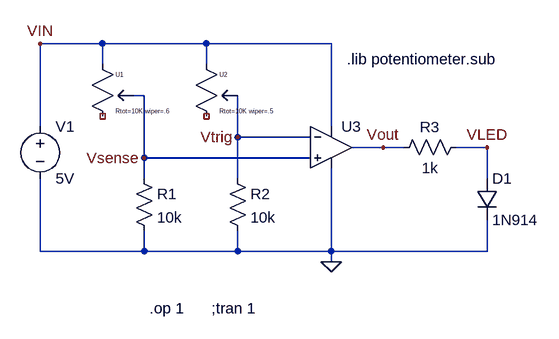
[diagram p0: schematic gas_detector_milestone1.asc]
gas_detector_milestone1.asc, the LTspice schematic file:
Version 4
SHEET 1 928 680
WIRE 96 96 0 96
WIRE 256 96 96 96
WIRE 448 96 256 96
WIRE 96 128 96 96
WIRE 256 128 256 96
WIRE 160 176 144 176
WIRE 0 224 0 96
WIRE 448 224 448 96
WIRE 304 240 304 176
WIRE 416 240 304 240
WIRE 528 256 480 256
WIRE 560 256 528 256
WIRE 688 256 640 256
WIRE 160 272 160 176
WIRE 416 272 160 272
WIRE 160 304 160 272
WIRE 304 304 304 240
WIRE 688 304 688 256
WIRE 0 416 0 304
WIRE 160 416 160 384
WIRE 160 416 0 416
WIRE 304 416 304 384
WIRE 304 416 160 416
WIRE 448 416 448 288
WIRE 448 416 304 416
WIRE 688 416 688 368
WIRE 688 416 448 416
WIRE 448 432 448 416
FLAG 448 432 0
FLAG 0 96 VIN
FLAG 160 272 Vsense
FLAG 304 240 Vtrig
FLAG 688 256 VLED
FLAG 528 256 Vout
SYMBOL potentiometer 80 112 R0
SYMATTR InstName U1
SYMATTR Value Rtot=10K wiper=.6
SYMBOL voltage 0 208 R0
WINDOW 123 0 0 Left 0
WINDOW 39 0 0 Left 0
SYMATTR InstName V1
SYMATTR Value 5V
SYMBOL res 288 288 R0
SYMATTR InstName R2
SYMATTR Value 10k
SYMBOL res 144 288 R0
SYMATTR InstName R1
SYMATTR Value 10k
SYMBOL diode 672 304 R0
SYMATTR InstName D1
SYMATTR Value 1N914
SYMATTR Description Light Emitting Diode
SYMATTR Type led
SYMBOL res 656 240 R90
WINDOW 0 0 56 VBottom 2
WINDOW 3 32 56 VTop 2
SYMATTR InstName R3
SYMATTR Value 1k
SYMBOL potentiometer 240 112 R0
SYMATTR InstName U2
SYMBOL OpAmps\\UniversalOpAmp2 448 256 R0
SYMATTR InstName U3
TEXT 168 504 Left 2 !.op 1
TEXT 472 120 Left 2 !.lib potentiometer.sub
TEXT 264 504 Left 2 !;tran 1

The netlist it stands for:
* gas_detector_milestone1.asc
XU1 VIN NC_01 Vsense potentiometer Rtot=10K wiper=.6  ; pins A B C
V1 VIN 0 5V
R2 Vtrig 0 10k
R1 Vsense 0 10k
D1 VLED 0 1N914
R3 VLED Vout 1k
XU2 VIN NC_02 Vtrig potentiometer Rtot=10K wiper=.5  ; pins A B C
XU3 Vsense Vtrig VIN 0 Vout level2 Avol=1Meg GBW=10Meg Slew=10Meg Ilimit=25m Rail=0 Vos=0 En=0 Enk=0 In=0 Ink=0 Rin=500Meg  ; pins In+ In- V+ V- OUT
.model D D
.lib standard.dio
.op 1
.lib potentiometer.sub
;tran 1
.lib UniversalOpAmp2.lib
.backanno
.end